# Altium schematic sheet Controller.SchDoc: Homemade Microcontroller
size A4; DrawnBy: Grady Kwetala; Revision: V1.0
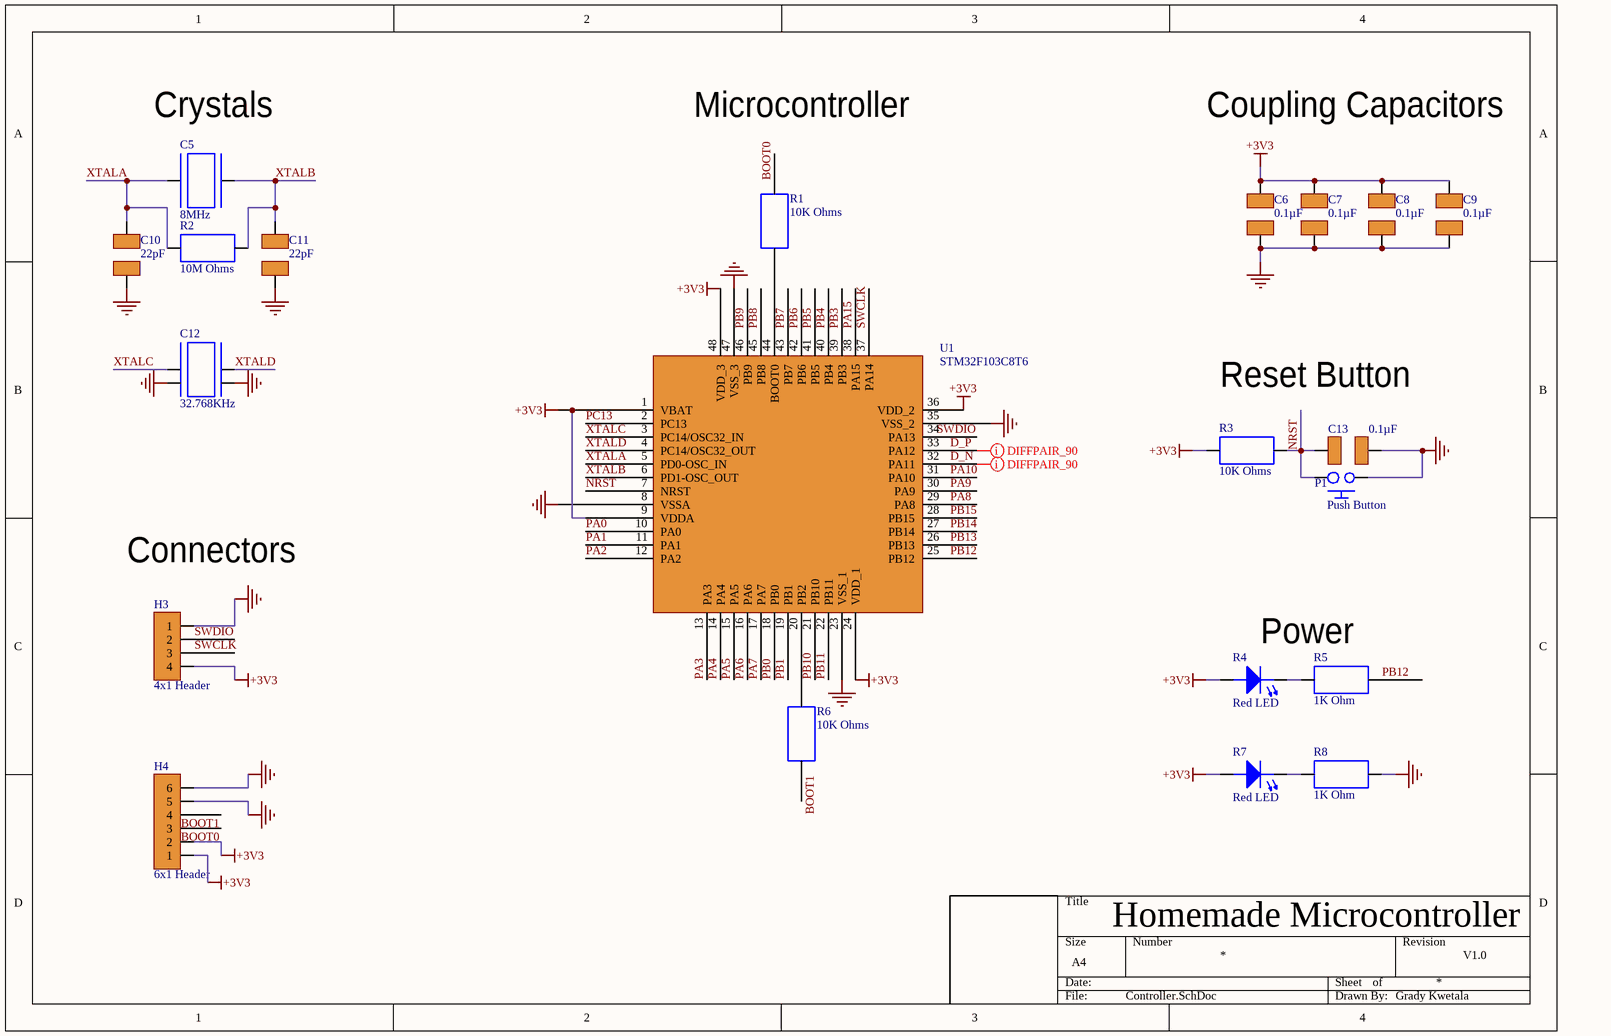
[diagram p0: Controller.SchDoc]

## Parts
C5  8MHz  [Crystal 8MHz]
C6  0.1µF  [capacitor]
C7  0.1µF  [capacitor]
C8  0.1µF  [capacitor]
C9  0.1µF  [capacitor]
C10  22pF  [capacitor]
C11  22pF  [capacitor]
C12  32.768KHz  [Crystal 32KHz]
C13  0.1µF  [capacitor]
H3  4x1 Header  [4 Pin Header]
H4  6x1 Header  [6 Pin Header]
P1  Push Button  [Push Button]
R1  10K Ohms  [Resistor]
R2  10M Ohms  [Resistor]
R3  10K Ohms  [Resistor]
R4  Red LED  [LED]
R5  1K Ohm  [Resistor]
R6  10K Ohms  [Resistor]
R7  Red LED  [LED]
R8  1K Ohm  [Resistor]
U1  STM32F103C8T6  [Micro controller]

## Nets
+3V3: C6.2 C7.2 C8.2 C9.2 H3.4 H4.1 H4.2 R3.2 R4.2 R7.2 U1.1(VBAT) U1.9(VDDA) U1.24(VDD_1) U1.36(VDD_2) U1.48(VDD_3)
GND: C6.1 C7.1 C8.1 C9.1 C10.1 C11.1 C12.3 C12.4 C13.1 H3.1 H4.5 H4.6 P1.1 R8.1 U1.8(VSSA) U1.23(VSS_1) U1.35(VSS_2) U1.47(VSS_3)
BOOT0: H4.3 R1.2
BOOT1: H4.4 R6.1
D_N: U1.32(PA11)
D_P: U1.33(PA12)
NRST: C13.2 P1.2 R3.1 U1.7(NRST)
PA0: U1.10(PA0)
PA1: U1.11(PA1)
PA2: U1.12(PA2)
PA3: U1.13(PA3)
PA4: U1.14(PA4)
PA5: U1.15(PA5)
PA6: U1.16(PA6)
PA7: U1.17(PA7)
PA8: U1.29(PA8)
PA9: U1.30(PA9)
PA10: U1.31(PA10)
PA15: U1.38(PA15)
PB0: U1.18(PB0)
PB1: U1.19(PB1)
PB3: U1.39(PB3)
PB4: U1.40(PB4)
PB5: U1.41(PB5)
PB6: U1.42(PB6)
PB7: U1.43(PB7)
PB8: U1.45(PB8)
PB9: U1.46(PB9)
PB10: U1.21(PB10)
PB11: U1.22(PB11)
PB12: R5.1 U1.25(PB12)
PB13: U1.26(PB13)
PB14: U1.27(PB14)
PB15: U1.28(PB15)
PC13: U1.2(PC13)
SWCLK: H3.3 U1.37(PA14)
SWDIO: H3.2 U1.34(PA13)
XTALA: C5.1 C10.2 R2.1 U1.5(PD0-OSC_IN)
XTALB: C5.2 C11.2 R2.2 U1.6(PD1-OSC_OUT)
XTALC: C12.1 U1.3(PC14/OSC32_IN)
XTALD: C12.2 U1.4(PC14/OSC32_OUT)
NetR1_1: R1.1 U1.44(BOOT0)
NetR4_1: R4.1 R5.2
NetR6_2: R6.2 U1.20(PB2)
NetR7_1: R7.1 R8.2

## Layout directives
differential pair; differential pair class diff_90: D_N, D_P

## Notes on the sheet
- Crystals
- Microcontroller
- Coupling Capacitors
- Reset Button
- Connectors
- Power

## Library data of the parts
C5 = ECS-80-20-5PX-TR: CRYSTAL 8.000 MHZ 20PF SMD; Manufacturer: ECS International; ESR (Equivalent Series Resistance): 60R; Frequency Stability: 50ppm; Frequency Tolerance: 30ppm; Supplier 1: Digi-Key; Supplier Part Number 1: XC2076CT-ND; Manufacturer Part Number: ECS-80-20-5PX-TR; Stock 1: 2393; Pricing 1: 1=0.30000, 10=0.24800, 50=0.22280, 100=0.19800, 500=0.18810 (USD); RoHS: Yes; Mount: Surface Mount; Min Operating Temperature: -10°C; Max Operating Temperature: 70°C; Frequency: 8MHz; Load Capacitance: 20pF; Packaging: Tape and Reel; Length: 0.449inch; Height: 0.169inch; Width: 0.189inch; Lead Free: Lead Free; ComponentLink1URL: http://www.ecsxtal.com/store/pdf/partnumber4.pdf?src-supplier=Digi-Key; ComponentLink1Description: http://www.ecsxtal.com/store/pdf/partnumber4.pdf?src-supplier=Digi-Key; ComponentLink2URL: http://www.ecsxtal.com/store/pdf/csm-7x.pdf?src-supplier=Digi-Key; ComponentLink2Description: http://www.ecsxtal.com/store/pdf/csm-7x.pdf?src-supplier=Digi-Key
C6-C9 C13 = C0805C104J5RACTU: KEMET - C0805C104J5RACTU - SMD Multilayer Ceramic Capacitor, 0.1 µF, 50 V, 0805 [2012 Metric], ± 5%, X7R, C Series KEMET; Capacitance: 100nF; Voltage Rating (DC): 50V; Supplier 1: Digi-Key; Supplier Part Number 1: 399-1171-1-ND; Manufacturer: KEMET; Manufacturer Part Number: C0805C104J5RACTU; Stock 1: 675679; Pricing 1: 1=0.19000, 10=0.13100, 100=0.06630, 500=0.04538, 1000=0.04015 (USD); RoHS: Yes; Mount: Surface Mount,PCB; Case/Package: 0805; Number of Pins: 2; Dielectric Material: Ceramic; Case Code (Metric): 2012; Case Code (Imperial): 0805; Contact Plating: Tin,Matte; Min Operating Temperature: -55°C; Max Operating Temperature: 125°C; Packaging: Tape and Reel; Tolerance: 5%; Dielectric: X7R; Voltage Rating: 50V; Package Quantity: 1; Termination: SMD/SMT; Voltage: 50V; Length: 2mm; Height: 0.9mm; Width: 0.049inch; Thickness: 0.035inch; Lead Pitch: 0.75mm; Depth: 1.25mm; Radiation Hardening: No; REACH SVHC: No SVHC; ComponentLink1URL: https://datasheet.ciiva.com/7842/1732721-7842179.pdf?src-supplier=Element14; ComponentLink1Description: https://datasheet.ciiva.com/7842/1732721-7842179.pdf?src-supplier=Element14; ComponentLink2URL: https://datasheet.ciiva.com/14589/70095383-14589015.pdf?src-supplier=Allied+Electronics; ComponentLink2Description: https://datasheet.ciiva.com/14589/70095383-14589015.pdf?src-supplier=Allied+Electronics; ComponentLink3URL: https://datasheet.ciiva.com/5417/kem-c1002-x7r-smd-5417352.pdf?src-supplier=Mouser; ComponentLink3Description: https://datasheet.ciiva.com/5417/kem-c1002-x7r-smd-5417352.pdf?src-supplier=Mouser; ComponentLink4URL: https://datasheet.ciiva.com/39122/docfinderpartnumberc0402c102k5ractu-39122924.pdf?src-supplier=Onlinecomponents.com; ComponentLink4Description: https://datasheet.ciiva.com/39122/docfinderpartnumberc0402c102k5ractu-39122924.pdf?src-supplier=Onlinecomponents.com; ComponentLink5URL: https://datasheet.ciiva.com/7258/1828800-7258413.pdf?src-supplier=Newark; ComponentLink5Description: https://datasheet.ciiva.com/7258/1828800-7258413.pdf?src-supplier=Newark; ComponentLink6URL: https://datasheet.ciiva.com/28682/1851736-28682223.pdf?src-supplier=Element14; ComponentLink6Description: https://datasheet.ciiva.com/28682/1851736-28682223.pdf?src-supplier=Element14
C10 C11 = C0805C220J5GACTU: Capacitor: ceramic; MLCC; 22pF; 50VDC; C0G; ±5%; SMD; 0805; Manufacturer: KEMET; Temperature Coefficient: 30ppm/°C; Voltage Rating: 50V; Supplier 1: Digi-Key; Supplier Part Number 1: 399-1113-1-ND; Manufacturer Part Number: C0805C220J5GACTU; Stock 1: 658795; Pricing 1: 1=0.10000, 10=0.07000, 100=0.03100, 500=0.02214, 1000=0.01739 (USD); RoHS: Yes; Mount: PCB,Surface Mount; Case/Package: 0805; Weight: 0.000194oz; Case Code (Metric): 2012; Case Code (Imperial): 0805; Contact Plating: Tin,Matte; Dielectric Material: Ceramic; Contact Material: Tin; Min Operating Temperature: -55°C; Max Operating Temperature: 125°C; Dielectric: C0G; Packaging: Tape and Reel; Capacitance: 22pF; Tolerance: 5%; Package Quantity: 1; Voltage Rating (DC): 50V; Termination: SMD/SMT; Voltage: 50V; Length: 2mm; Height: 0.78mm; Width: 1.25mm; Thickness: 0.035inch; Depth: 1.25mm; Radiation Hardening: No; Lead Free: Lead Free; REACH SVHC: No SVHC; ComponentLink1URL: https://datasheet.ciiva.com/7842/kem-c1003-c0g-smd-7842569.pdf?src-supplier=Element14; ComponentLink1Description: https://datasheet.ciiva.com/7842/kem-c1003-c0g-smd-7842569.pdf?src-supplier=Element14; ComponentLink2URL: https://datasheet.ciiva.com/28668/1789732-28668761.pdf?src-supplier=Element14; ComponentLink2Description: https://datasheet.ciiva.com/28668/1789732-28668761.pdf?src-supplier=Element14; ComponentLink3URL: https://datasheet.ciiva.com/7842/1372242-7842570.pdf?src-supplier=Element14; ComponentLink3Description: https://datasheet.ciiva.com/7842/1372242-7842570.pdf?src-supplier=Element14
C12 = ECS-.327-12.5-34B-C-TR: Crystals 32.768KHz 12.5pF; Manufacturer: ECS International; Frequency Tolerance: 10ppm; ESR (Equivalent Series Resistance): 70kR; Supplier 1: Digi-Key; Supplier Part Number 1: XC1968CT-ND; Manufacturer Part Number: ECS-.327-12.5-34B-C-TR; Stock 1: 21159; Pricing 1: 1=0.74000, 10=0.65800, 50=0.61500, 100=0.54340, 500=0.51480, 1000=0.42900 (USD); RoHS: Yes; Mount: Surface Mount; Case/Package: SMD/SMT; Number of Pins: 2; Min Operating Temperature: -40°C; Max Operating Temperature: 85°C; Package Quantity: 3000; Packaging: Tape and Reel; Frequency: 32.768kHz; Load Capacitance: 12.5pF; Termination: SMD/SMT; Frequency Stability: 10ppm; Length: 0.126inch; Height: 0.035inch; Width: 0.061inch; Lead Pitch: 2.4mm; Lead Free: Lead Free; ComponentLink1URL: http://www.mouser.com/ds/2/122/ecx-31b-1108368.pdf?src-supplier=Mouser; ComponentLink1Description: http://www.mouser.com/ds/2/122/ecx-31b-1108368.pdf?src-supplier=Mouser; ComponentLink2URL: http://www.ecsxtal.com/store/pdf/partnumber4.pdf?src-supplier=Digi-Key; ComponentLink2Description: http://www.ecsxtal.com/store/pdf/partnumber4.pdf?src-supplier=Digi-Key
H3 = 22-23-2041: Conn Wire to Board HDR 4 POS 2.54mm Solder ST Thru-Hole KK® Bag; Manufacturer: Molex; Number of Positions: 4; Contact Resistance: 10mR; Gender: Male; Max Voltage Rating (AC): 600V; Max Current Rating: 7A; Current Rating: 4A; Voltage Rating: 250V; Insulation Resistance: 500GR; Number of Lines: 1; Approvals: UL,CSA; Glow Wire Compliant: Non-compliant; Supplier 1: Digi-Key; Supplier Part Number 1: WM4202-ND; Manufacturer Part Number: 22-23-2041; Stock 1: 33520; Pricing 1: 1=0.28000, 10=0.26700, 100=0.18720, 500=0.16044, 1000=0.13370, 5000=0.11460, 10000=0.10696 (USD); RoHS: Yes; Mount: Cable,Through Hole; Color: White; Housing Material: Nylon; Housing Color: Orange; Contact Material: Brass,Copper Alloy,Tin; Contact Plating: Tin,Copper; Min Operating Temperature: -55°C; Max Operating Temperature: 75°C; Orientation: Straight; Termination: Through Hole; Number of Contacts: 4; Number of Rows: 1; Packaging: Bulk; Number of Circuits: 4; Package Quantity: 2000; Number of Poles: 4; Voltage Rating (DC): 250V; Contact Gender: Male; Length: 19.81mm; Height: 18.42mm; Pitch: 2.54mm; Depth: 9.02mm; Radiation Hardening: No; REACH SVHC: Unknown; Flammability Rating: UL94 V-0; Halogen Free: Low Halogen; Lead Free: Lead Free; ComponentLink1URL: https://datasheet.ciiva.com/19462/1966245-19462162.pdf?src-supplier=Jameco; ComponentLink1Description: https://datasheet.ciiva.com/19462/1966245-19462162.pdf?src-supplier=Jameco; ComponentLink2URL: https://datasheet.ciiva.com/5151/0022232041-pcb-headers-227043-5151795.pdf?src-supplier=Mouser; ComponentLink2Description: https://datasheet.ciiva.com/5151/0022232041-pcb-headers-227043-5151795.pdf?src-supplier=Mouser; ComponentLink3URL: https://datasheet.ciiva.com/19454/232282-19454309.pdf?src-supplier=Jameco; ComponentLink3Description: https://datasheet.ciiva.com/19454/232282-19454309.pdf?src-supplier=Jameco; ComponentLink4URL: https://datasheet.ciiva.com/11747/0900766b80d8f4d1-11747883.pdf?src-supplier=RSComponents; ComponentLink4Description: https://datasheet.ciiva.com/11747/0900766b80d8f4d1-11747883.pdf?src-supplier=RSComponents; ComponentLink5URL: https://datasheet.ciiva.com/16725/0022232041-pcb-headers-16725643.pdf?src-supplier=Avnet+Europe; ComponentLink5Description: https://datasheet.ciiva.com/16725/0022232041-pcb-headers-16725643.pdf?src-supplier=Avnet+Europe; ComponentLink6URL: https://datasheet.ciiva.com/7106/1859840-7106278.pdf?src-supplier=Newark; ComponentLink6Description: https://datasheet.ciiva.com/7106/1859840-7106278.pdf?src-supplier=Newark; ComponentLink7URL: https://datasheet.ciiva.com/7843/1896518-7843901.pdf?src-supplier=Element14; ComponentLink7Description: https://datasheet.ciiva.com/7843/1896518-7843901.pdf?src-supplier=Element14
H4 = 22-27-2061: 6 Way 2.54mm Kk Molex Straight Header; Number of Contacts: 6; Connector Type: Male Pin; Gender: Male; Contact Resistance: 10mR; Supplier 1: Digi-Key; Supplier Part Number 1: WM4115-ND; Manufacturer: Molex; Manufacturer Part Number: 22-27-2061; Stock 1: 2007; Pricing 1: 1=0.49000, 10=0.46000, 100=0.35240, 500=0.30640, 1000=0.25278, 5000=0.22214, 10000=0.20682 (USD); RoHS: Yes; Mount: Through Hole; Color: Natural; Housing Color: White; Housing Material: Nylon; Contact Material: Brass; Contact Plating: Tin,Copper; Min Operating Temperature: 0°C; Max Operating Temperature: 75°C; Termination: Solder; Number of Rows: 1; Packaging: Bulk; Number of Positions: 6; Orientation: Straight; Fastening Type: Friction; Length: 15.24mm; Pitch: 2.54mm; Depth: 5.8mm; Contact Mating Length: 0.295inch; ComponentLink1URL: https://datasheet.ciiva.com/716/022272051-sd-716503.pdf?src-supplier=Digi-Key; ComponentLink1Description: https://datasheet.ciiva.com/716/022272051-sd-716503.pdf?src-supplier=Digi-Key; ComponentLink2URL: https://datasheet.ciiva.com/11746/0900766b80462750-11746243.pdf?src-supplier=RSComponents; ComponentLink2Description: https://datasheet.ciiva.com/11746/0900766b80462750-11746243.pdf?src-supplier=RSComponents; ComponentLink3URL: https://datasheet.ciiva.com/15217/getdatasheetpartid-176662-15217687.pdf?src-supplier=Verical; ComponentLink3Description: https://datasheet.ciiva.com/15217/getdatasheetpartid-176662-15217687.pdf?src-supplier=Verical; ComponentLink4URL: https://datasheet.ciiva.com/16468/0022272061-pcb-headers-16468939.pdf?src-supplier=Avnet+Asia; ComponentLink4Description: https://datasheet.ciiva.com/16468/0022272061-pcb-headers-16468939.pdf?src-supplier=Avnet+Asia; ComponentLink5URL: https://datasheet.ciiva.com/20207/22-0838e-20207118.pdf?src-supplier=Rapid+Electronics; ComponentLink5Description: https://datasheet.ciiva.com/20207/22-0838e-20207118.pdf?src-supplier=Rapid+Electronics
P1 = 430451025836: SWITCH TACTILE SPST-NO 0.05A 12V; Manufacturer: Wurth Electronics; Mechanical Life: 200000Cycles; Actuator Material: Polymer,Liquid Crystal Polymer; Illumination Type: Non-Illuminated; Operating Force: 360gf; Throw Configuration: SPST; Switch Travel: 0.25mm; Switch Function: Off-Mom; Actuator Type: Standard; Supplier 1: Digi-Key; Manufacturer Part Number: 430451025836; RoHS: Yes; Category: Tactile Switches; Stock 1: 12966; Pricing 1: 1=0.49000, 50=0.45800, 100=0.41600, 500=0.37800, 1000=0.32900 (USD); Mount: Surface Mount; Min Operating Temperature: -40°C; Max Operating Temperature: 85°C; Packaging: Tape and Reel; Termination: SMD/SMT; ComponentLink1URL: https://katalog.we-online.de/em/datasheet/430451025836.pdf?src-supplier=Digi-Key; ComponentLink1Description: https://katalog.we-online.de/em/datasheet/430451025836.pdf?src-supplier=Digi-Key; Supplier Part Number 1: 732-7010-1-ND
R1 R3 R6 = PHT0603Y1002BGT: RES SMD 10KOHM 0.1% 0.0375W 0603; Manufacturer: Vishay Sfernice; Resistance: 10kR; Temperature Coefficient: 15ppm/°C; Voltage Rating: 75V; Power Rating: 12.5mW; Supplier 1: Digi-Key; Supplier Part Number 1: PHTB-10KCT-ND; Manufacturer Part Number: PHT0603Y1002BGT; Stock 1: 173; Pricing 1: 1=11.30000, 10=10.59500, 100=7.53460 (USD); RoHS: Yes; Case/Package: 0603; Number of Pins: 2; Case Code (Imperial): 0603; Case Code (Metric): 1608; Min Operating Temperature: -55°C; Max Operating Temperature: 215°C; Tolerance: 0.1%; Packaging: Tape and Reel; Composition: Thin Film; Termination: SMD/SMT; Voltage Rating (DC): 75V; Length: 1.6mm; Height: 0.5mm; Width: 0.8mm; Radiation Hardening: No; REACH SVHC: No SVHC; ComponentLink1URL: https://datasheet.ciiva.com/9052/pht-9052382.pdf?src-supplier=Avnet; ComponentLink1Description: https://datasheet.ciiva.com/9052/pht-9052382.pdf?src-supplier=Avnet
R2 = HVC0805T1005JET: RES SMD 10M OHM 5% 1/8W 0805; Manufacturer: Ohmite; Temperature Coefficient: 100ppm/°C; Max Power Dissipation: 125mW; Voltage Rating (DC): 200V; Resistance: 10MR; Supplier 1: Digi-Key; Supplier Part Number 1: HVC0805T1005JETCT-ND; Manufacturer Part Number: HVC0805T1005JET; Stock 1: 256; Pricing 1: 1=2.32000, 10=2.05700, 100=1.57080 (USD); RoHS: Yes; Case/Package: 0805; Case Code (Imperial): 0805; Case Code (Metric): 2012; Min Operating Temperature: -55°C; Max Operating Temperature: 155°C; Termination: SMD/SMT; Composition: Thick Film; Number of Terminations: 2; Tolerance: 5%; Power Rating: 125mW; Voltage Rating: 200V; Packaging: Tape and Reel; Package Quantity: 1; Length: 0.079inch; Height: 0.022inch; Depth: 1.25mm; Width: 0.049inch; REACH SVHC: Unknown; ComponentLink1URL: https://datasheet.ciiva.com/7763/hvc-7763831.pdf?src-supplier=Element14; ComponentLink1Description: https://datasheet.ciiva.com/7763/hvc-7763831.pdf?src-supplier=Element14; ComponentLink2URL: https://datasheet.ciiva.com/2517/res-hvc-2517979.pdf?src-supplier=Digi-Key; ComponentLink2Description: https://datasheet.ciiva.com/2517/res-hvc-2517979.pdf?src-supplier=Digi-Key; ComponentLink3URL: https://datasheet.ciiva.com/2517/res-hvc-2517980.pdf?src-supplier=Digi-Key; ComponentLink3Description: https://datasheet.ciiva.com/2517/res-hvc-2517980.pdf?src-supplier=Digi-Key; ComponentLink4URL: https://datasheet.ciiva.com/2517/res-hvc-2517981.pdf?src-supplier=Digi-Key; ComponentLink4Description: https://datasheet.ciiva.com/2517/res-hvc-2517981.pdf?src-supplier=Digi-Key; ComponentLink5URL: https://datasheet.ciiva.com/16770/70024806-16770190.pdf?src-supplier=Allied+Electronics; ComponentLink5Description: https://datasheet.ciiva.com/16770/70024806-16770190.pdf?src-supplier=Allied+Electronics
R4 R7 = LHR974-LP-1: LED RED DIFFUSED 0805 SMD; Manufacturer: Osram Opto; Reverse Voltage: 5V; Dominant Wavelength: 645nm; Number of Elements: 1; Test Current: 20mA; Forward Current: 30mA; Forward Voltage: 2.6V; Lens Style: Diffused,Colorless; Luminous Intensity: 15mcd; Viewing Angle: 160°; Supplier 1: Digi-Key; Supplier Part Number 1: SML-D12U1WT86CT-ND; Manufacturer Part Number: LHR974-LP-1; RoHS: Yes; Mount: Surface Mount; Number of Pins: 2; Min Operating Temperature: -30°C; Max Operating Temperature: 85°C; Packaging: Tape and Reel; Length: 2.1mm; Depth: 1.35mm; Radiation Hardening: No; ComponentLink1URL: http://components.arrow.com/part/dataview/0323_01825492?src-supplier=Arrow+Europe; ComponentLink1Description: http://components.arrow.com/part/dataview/0323_01825492?src-supplier=Arrow+Europe; ComponentLink2URL: http://www.jameco.com/Jameco/Products/ProdDS/2085634.pdf?src-supplier=Jameco; ComponentLink2Description: http://www.jameco.com/Jameco/Products/ProdDS/2085634.pdf?src-supplier=Jameco; ComponentLink3URL: http://www.mouser.com/ds/2/311/LH%20R974%20-%20CHIPLED%200805-318659.pdf?src-supplier=Mouser; ComponentLink3Description: http://www.mouser.com/ds/2/311/LH%20R974%20-%20CHIPLED%200805-318659.pdf?src-supplier=Mouser; ComponentLink4URL: https://dammedia.osram.info/media/resource/hires/osram-dam-2493888/LH%20R974.pdf?src-supplier=Digi-Key; ComponentLink4Description: https://dammedia.osram.info/media/resource/hires/osram-dam-2493888/LH%20R974.pdf?src-supplier=Digi-Key; ComponentLink5URL: https://www.verical.com/server-webapp/html/getDatasheet?partID=258950&src-supplier=Verical; ComponentLink5Description: https://www.verical.com/server-webapp/html/getDatasheet?partID=258950&src-supplier=Verical; ComponentLink6URL: http://components.arrow.com/part/dataview/41971690S1077610N9133?src-supplier=Arrow; ComponentLink6Description: http://components.arrow.com/part/dataview/41971690S1077610N9133?src-supplier=Arrow; ComponentLink7URL: http://components.arrow.com/part/dataview/41971690S6190115N2128?src-supplier=Arrow; ComponentLink7Description: http://components.arrow.com/part/dataview/41971690S6190115N2128?src-supplier=Arrow
R5 R8 = CRGP2512F1K0: TE CONNECTIVITY - CRGP2512F1K0 - SMD Chip Resistor, 2512 [6432 Metric], 1 kohm, CRGP Series, 500 V, Thick Film, 2 W; Resistance: 1kR; Tolerance: 1%; Max Power Dissipation: 2W; Temperature Coefficient: 100ppm/°C; Supplier 1: Digi-Key; Supplier Part Number 1: A130721CT-ND; Manufacturer: TE Connectivity; Manufacturer Part Number: CRGP2512F1K0; Stock 1: 10481; Pricing 1: 1=0.50000, 10=0.35500, 100=0.18470, 1000=0.09947 (USD); RoHS: No; Case/Package: 2512; Min Operating Temperature: -55°C; Max Operating Temperature: 155°C; Composition: Thick Film; Packaging: Tape and Reel; Number of Terminations: 2; ComponentLink1URL: https://4donline.ihs.com/images/VipMasterIC/IC/TYEL/TYEL-S-A0005460475/TYEL-S-A0005460475-1.pdf?hkey=52A5661711E402568146F3353EA87419&src-supplier=Farnell; ComponentLink1Description: https://4donline.ihs.com/images/VipMasterIC/IC/TYEL/TYEL-S-A0005460475/TYEL-S-A0005460475-1.pdf?hkey=52A5661711E402568146F3353EA87419&src-supplier=Farnell; ComponentLink2URL: https://www.te.com/commerce/DocumentDelivery/DDEController?Action=srchrtrv&amp;DocNm=9-1773463-9&amp;DocType=DS&amp;DocLang=English&src-supplier=Digi-Key; ComponentLink2Description: https://www.te.com/commerce/DocumentDelivery/DDEController?Action=srchrtrv&amp;DocNm=9-1773463-9&amp;DocType=DS&amp;DocLang=English&src-supplier=Digi-Key; ComponentLink3URL: https://4donline.ihs.com/images/VipMasterIC/IC/TYEL/TYEL-S-A0005460475/TYEL-S-A0005460475-1.pdf?hkey=52A5661711E402568146F3353EA87419&src-supplier=Newark; ComponentLink3Description: https://4donline.ihs.com/images/VipMasterIC/IC/TYEL/TYEL-S-A0005460475/TYEL-S-A0005460475-1.pdf?hkey=52A5661711E402568146F3353EA87419&src-supplier=Newark; ComponentLink4URL: https://4donline.ihs.com/images/VipMasterIC/IC/TYEL/TYEL-S-A0005460475/TYEL-S-A0005460475-1.pdf?hkey=52A5661711E402568146F3353EA87419&src-supplier=Element14; ComponentLink4Description: https://4donline.ihs.com/images/VipMasterIC/IC/TYEL/TYEL-S-A0005460475/TYEL-S-A0005460475-1.pdf?hkey=52A5661711E402568146F3353EA87419&src-supplier=Element14; ComponentLink5URL: https://www.te.com/commerce/DocumentDelivery/DDEController?Action=srchrtrv&DocNm=9-1773463-9&DocType=DS&DocLang=English&src-supplier=Digi-Key; ComponentLink5Description: https://www.te.com/commerce/DocumentDelivery/DDEController?Action=srchrtrv&DocNm=9-1773463-9&DocType=DS&DocLang=English&src-supplier=Digi-Key
U1 = STM32F103C8T6: STMICROELECTRONICS - STM32F103C8T6 - ARM MCU, Motor Control, STM32 Family STM32F1 Series Microcontrollers, ARM Cortex-M3, 32bit, 72 MHz; RAM Size: 20KB; Density: 64KB; Frequency: 72MHz; Number of Bits: 32; Watchdog Timer: Yes; Peripherals: POR,PWM,WDT,DMA,Temp Sensor,I2C; Max Power Dissipation: 363mW; Interface: I2C,SPI,USB,CAN,IrDA,UART,USART,LIN; Number of I/Os: 37; Number of Timers/Counters: 4; Max Supply Voltage: 3.6V; Number of PWM Channels: 1; Number of ADC Channels: 10; Min Supply Voltage: 2V; Oscillator Type: Internal; Number of Programmable I/O: 48; Data Bus Width: 32b; Memory Type: FLASH; Number of SPI Channels: 2; Supplier 1: Digi-Key; Supplier Part Number 1: 497-6063-ND; Manufacturer: STMicroelectronics; Manufacturer Part Number: STM32F103C8T6; Stock 1: 1173; Pricing 1: 1=4.94000, 10=4.43700, 25=4.19480, 100=3.63540, 250=3.44896, 500=3.09474, 1000=2.61002, 2500=2.47952, 5000=2.38630 (USD); RoHS: Yes; Case/Package: LQFP; Number of Pins: 48; Min Operating Temperature: -40°C; Max Operating Temperature: 85°C; Packaging: Tray; Memory Size: 64KB; Core Architecture: ARM; Package Quantity: 250; Termination: SMD/SMT; Max Frequency: 72MHz; Number of I2C Channels: 2; Address Bus Width: 32b; Length: 7mm; Height: 1.45mm; Width: 7.2mm; Radiation Hardening: No; Lead Free: Lead Free; REACH SVHC: No SVHC; ComponentLink1URL: https://datasheet.ciiva.com/15122/getdatasheetpartid-69880-15122076.pdf?src-supplier=Verical; ComponentLink1Description: https://datasheet.ciiva.com/15122/getdatasheetpartid-69880-15122076.pdf?src-supplier=Verical; ComponentLink2URL: https://datasheet.ciiva.com/26816/stm32f103c8t6-26816902.pdf?src-supplier=IIIC; ComponentLink2Description: https://datasheet.ciiva.com/26816/stm32f103c8t6-26816902.pdf?src-supplier=IIIC; ComponentLink3URL: https://datasheet.ciiva.com/16210/cd00161566-16210248.pdf?src-supplier=Future+Electronics; ComponentLink3Description: https://datasheet.ciiva.com/16210/cd00161566-16210248.pdf?src-supplier=Future+Electronics; ComponentLink4URL: https://datasheet.ciiva.com/14100/pustm-arm-microcont-stm32f103-en-14100508.pdf?src-supplier=Distrelec; ComponentLink4Description: https://datasheet.ciiva.com/14100/pustm-arm-microcont-stm32f103-en-14100508.pdf?src-supplier=Distrelec; ComponentLink5URL: https://datasheet.ciiva.com/8054/1730126-8054942.pdf?src-supplier=Element14; ComponentLink5Description: https://datasheet.ciiva.com/8054/1730126-8054942.pdf?src-supplier=Element14; ComponentLink6URL: https://datasheet.ciiva.com/48687/001075658-da-01-en-mcu-64kb-mem-stm32f103c8t6-lqfp-48-stm-48687589.pdf?src-supplier=Conrad; ComponentLink6Description: https://datasheet.ciiva.com/48687/001075658-da-01-en-mcu-64kb-mem-stm32f103c8t6-lqfp-48-stm-48687589.pdf?src-supplier=Conrad